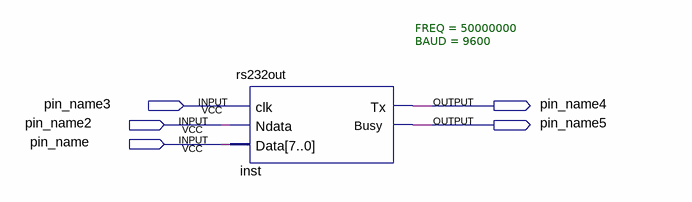
[diagram p0: schematic sheet]
// Quartus schematic rs232out.bdf as structural Verilog: 1 symbols, 5 pins
module rs232out (
  input  pin_name3,
  input  pin_name2,
  input  pin_name,
  output pin_name4,
  output pin_name5
);

  rs232out #(.FREQ(50000000), .BAUD(9600)) inst (
    .clk(pin_name3), .Ndata(pin_name2), .Data({8{pin_name}}), .Tx(pin_name4), .Busy(pin_name5));
endmodule
